# EAGLE design usb-condom (EAGLE 7.5.0)
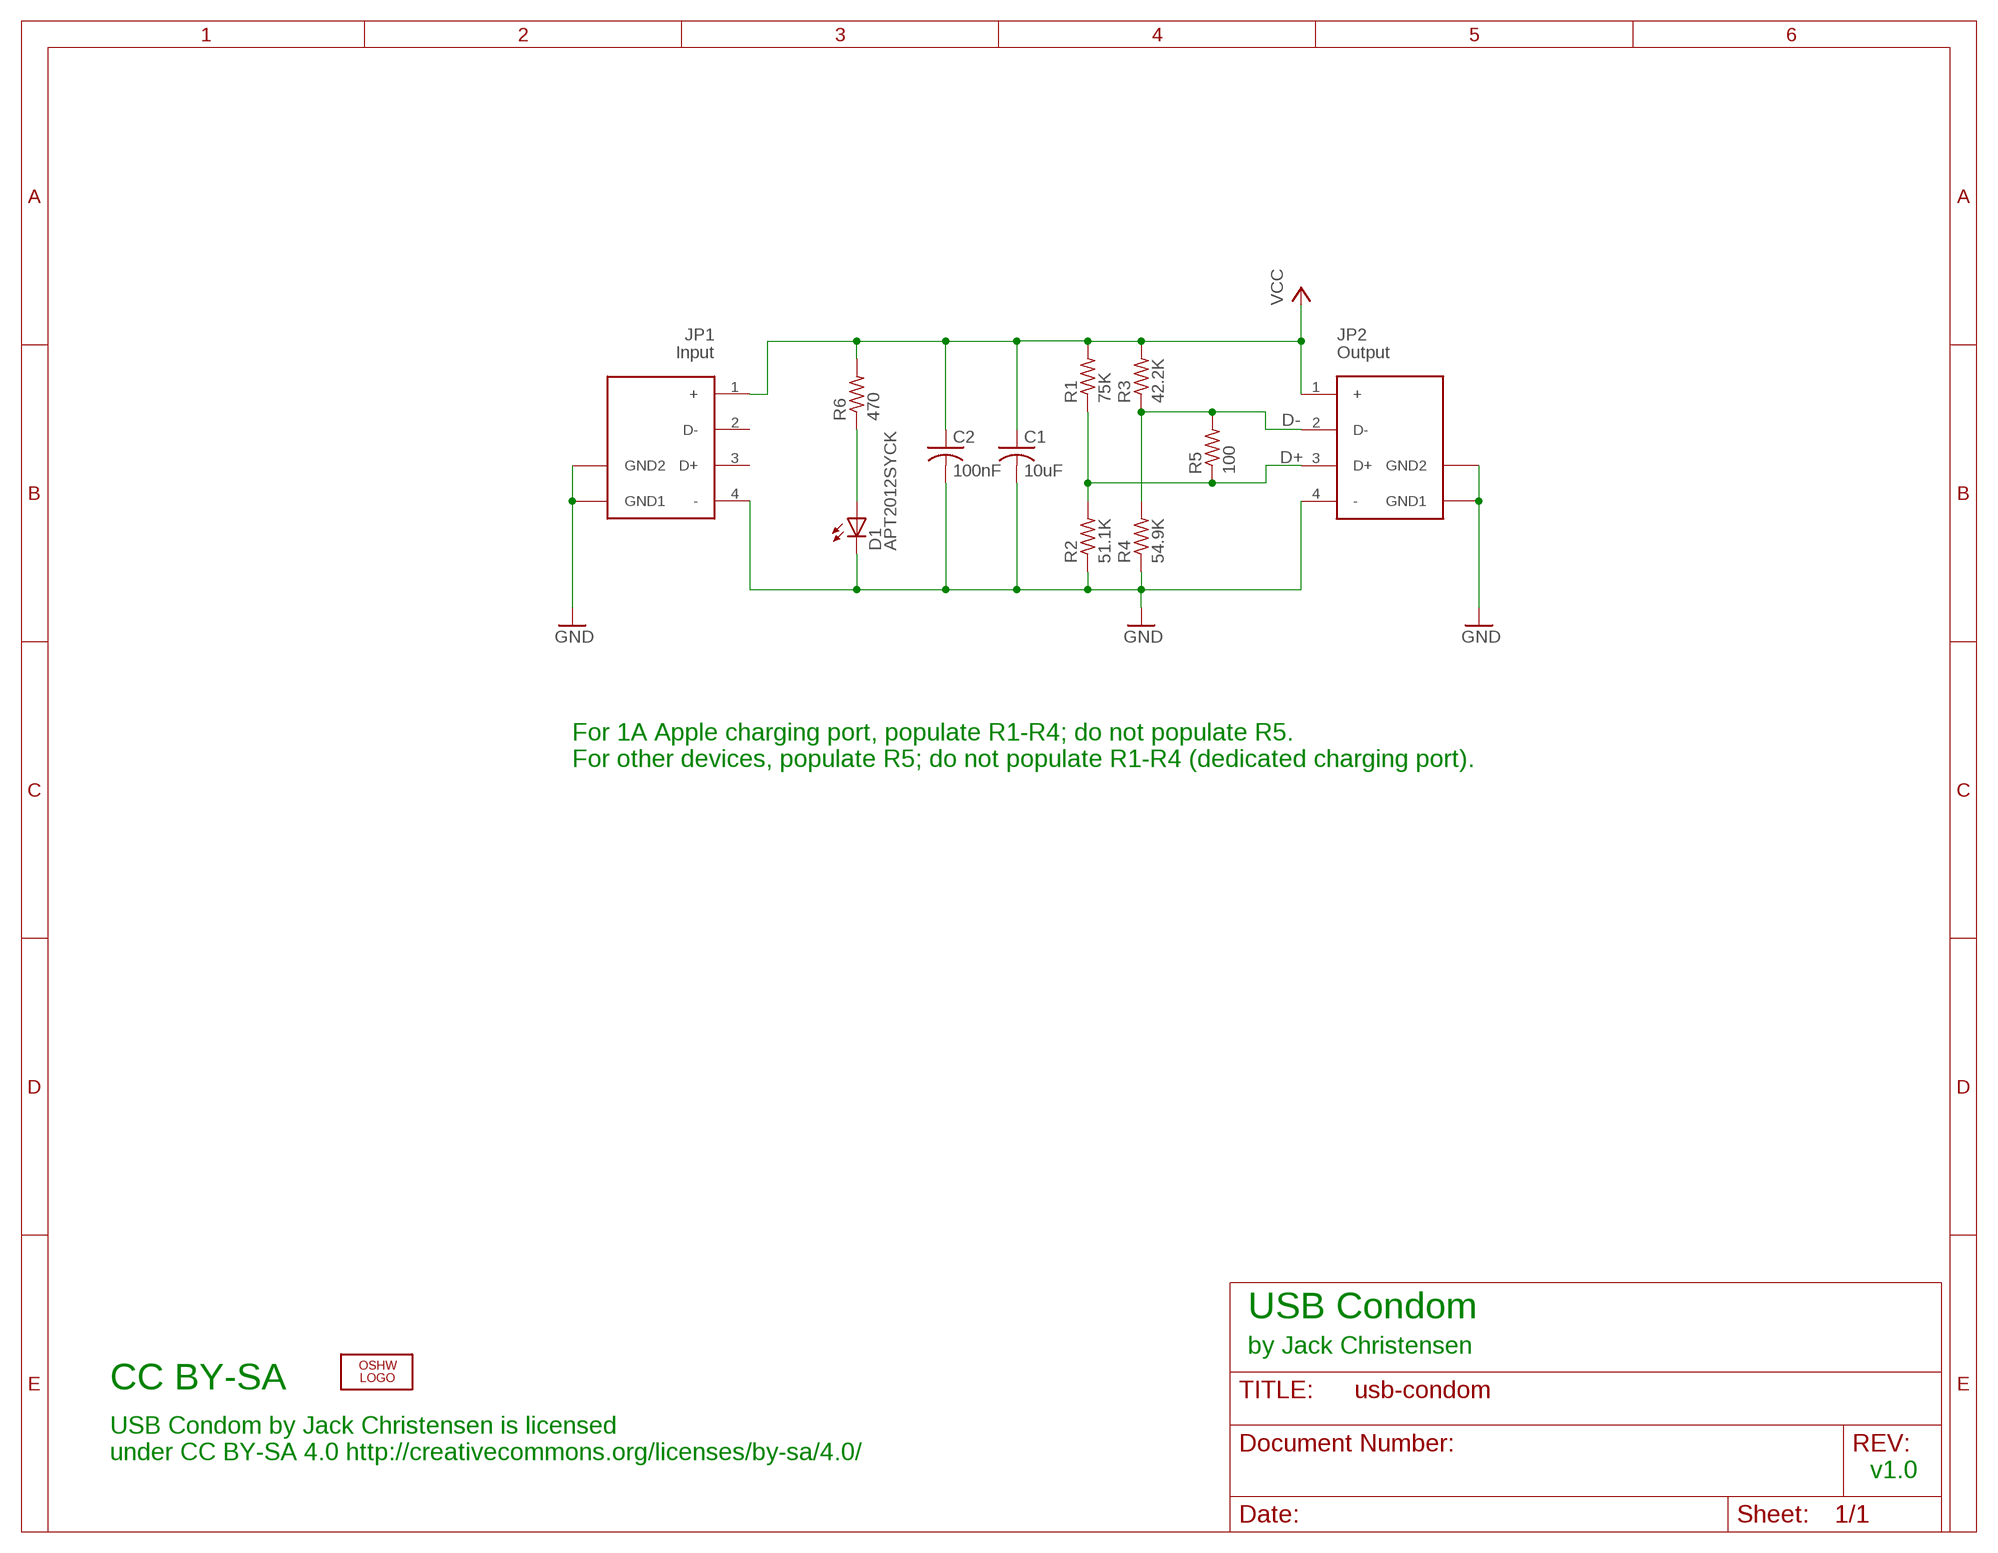
[diagram p0: schematic, sheet 1]

## Parts
C1  10uF  C-USM0805  [M0805]
C2  100nF  C-USM0805  [M0805]
D1  APT2012SYCK  LEDM0805  [M0805]
JP1  Input  UP2-AH-TH  [UP2-AH-X-TH]
JP2  Output  USB-A  [USB-A-S-RA-ADAMTECH]
LOGO1  OSHW_LOGO_8MILX0100-NT  [OSHW_8X100_NOTEXT]
R1  75K  R-US_M0805  [M0805]
R2  51.1K  R-US_M0805  [M0805]
R3  42.2K  R-US_M0805  [M0805]
R4  54.9K  R-US_M0805  [M0805]
R5  100  R-US_M0805  [M0805]
R6  470  R-US_M0805  [M0805]

## Nets
D+: JP2.3(D+) R1.1 R2.2 R5.1
D-: JP2.2(D-) R3.1 R4.2 R5.2
GND: C1.2 C2.2 D1.2(C) JP1.4(-) JP1.P$5(GND1) JP1.P$6(GND2) JP2.4(-) JP2.GND1 JP2.GND2 R2.1 R4.1
N$1: D1.1(A) R6.1
VCC: C1.1 C2.1 JP1.1(+) JP2.1(+) R1.2 R3.2 R6.2
Unconnected: JP1.2(D-) JP1.3(D+)

## Notes on the sheet
- For 1A Apple charging port, populate R1-R4; do not populate R5.
  For other devices, populate R5; do not populate R1-R4 (dedicated charging port).
- USB Condom
- by Jack Christensen
- CC BY-SA
- USB Condom by Jack Christensen is licensed
  under CC BY-SA 4.0 http://creativecommons.org/licenses/by-sa/4.0/
- v1.0

## Library data of the parts
C1 C2 = _jc:C-US: CAPACITOR, American symbol
D1 = _jc:LED: LED OSRAM: - CHIPLED LG R971, LG N971, LY N971, LG Q971, LY Q971, LO R971, LY R971 LH N974, LH R974 LS Q976, LO Q976, LY Q976 LO Q996 - Hyper CHIPLED LW Q18S LB Q993, LB Q99A, LB R99A - SideLED LS A670, LO A670, LY A670, LG A670, LP A670 LB A673, LV A673, LT A673, LW A673 LH A674 LY A675 LS A676, LA A676, LO A676, LY A676, LW A676 LS A679, LY A679, LG A679 - Hyper Micro SIDELED® LS Y876, LA Y876, LO Y876, LY Y876 LT Y87S - SmartLED LW L88C, LW L88S LB L89C, LB L89S, LG L890 LS L89K, LO L89K, LY L89K LS L896, LA L896, LO L896, LY L896 - TOPLED LS T670, LO T670, LY T670, LG T670, LP T670 LSG T670, LSP T670, LSY T670, LOP T670, LYG T670 LG T671, LOG T671, LSG T671 LB T673, LV T673, LT T673, LW T673 LH T674 LS T676, LA T676, LO T676, LY T676, LB T676, LH T676, LSB T676, LW T676 LB T67C, LV T67C, LT T67C, LS T67K, LO T67K, LY T67K, LW E67C LS E67B, LA E67B, LO E67B, LY E67B, LB E67C, LV E67C, LT E67C LW T67C LS T679, LY T679, LG T679 LS T770, LO T770, LY T770, LG T770, LP T770 LB T773, LV T773, LT T773, LW T773 LH T774 LS E675, LA E675, LY E675, LS T675 LS T776, LA T776, LO T776, LY T776, LB T776 LHGB T686 LT T68C, LB T68C - Hyper Mini TOPLED® LB M676 - Mini TOPLED Santana® LG M470 LS M47K, LO M47K, LY M47K Source: http://www.osram.convergy.de/
JP1 = _jc:UP2-AH-TH: CUI Inc. Series UP2-AH-TH Male USB plug.
JP2 = _jc:USB-A
LOGO1 = ohw-logo:OSHW_LOGO_8MIL
R1-R6 = _jc:R-US_: RESISTOR, American symbol

## Board
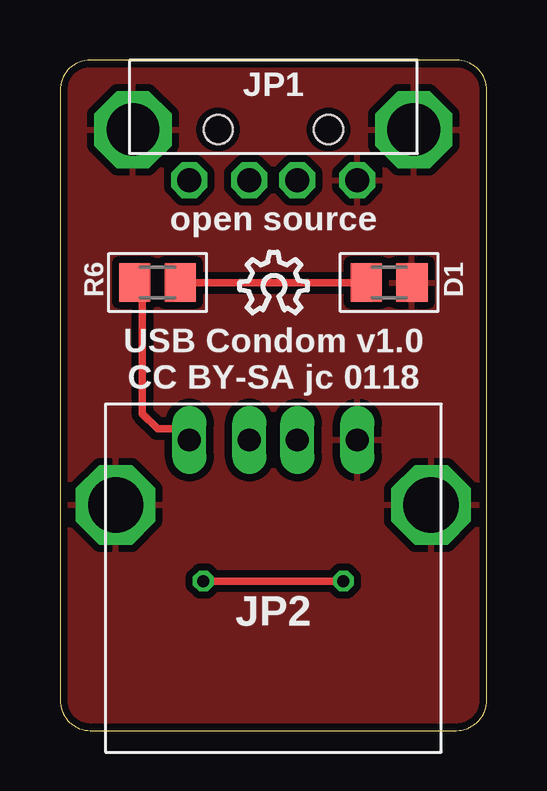
[diagram p1: board, top side]
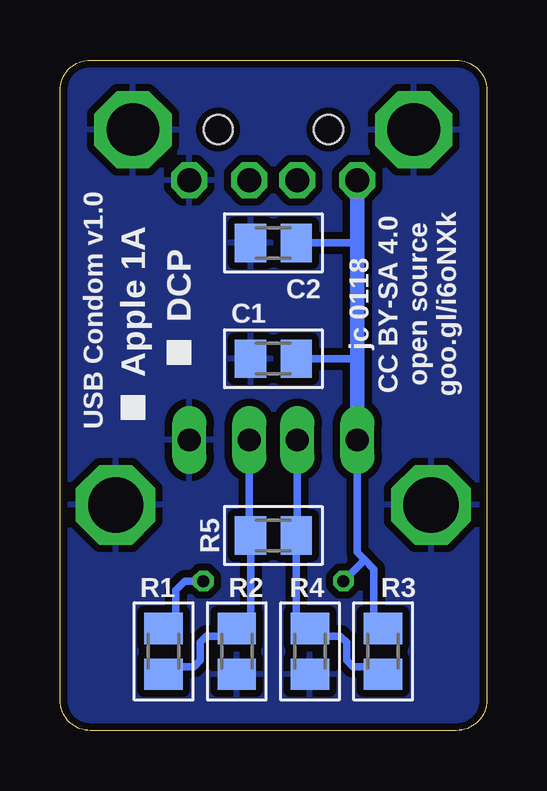
[diagram p2: board, bottom side, seen from below]

Size 17.78 x 27.94 mm. Coordinates in mm from the lower left corner, seen from the top.
Outline: 0,26.67 0,1.27 arc90 1.27,0 16.51,0 arc90 17.78,1.27 17.78,26.67 arc90 16.51,27.94 1.27,27.94 arc90 0,26.67
Copper layers (1*16): Top 0.0356mm / dielectric 1.5011mm / Bottom 0.0356mm
Design rules "oshpark-2layer-jc": minimum track width 8mil, minimum drill 13mil, track to track 8mil, track to pad 8mil, pad to pad 8mil, via to via 8mil, smd to smd 6mil, copper to edge 12mil, drill to drill 6mil, minimum pad ring 7mil, minimum via ring 7mil, stop-mask expansion 2.5mil, vias tented up to drill 20mil, thermal gap 12mil

### Footprints (pad centres in the part's own frame; a part is rotated, then mirrored left to right if it is on the bottom)
M0805 = smd 1.3 x 1.6: 1 -0.95,0; 2 0.95,0
UP2-AH-X-TH = drill 1 octagon: 1 3.5,5; 2 1,5; 3 -1,5; 4 -3.5,5 | drill 2.2 octagon: P$5 5.85,2.9; P$6 -5.85,2.9 | hole 1.2: 2.3,2.9; -2.3,2.9
USB-A-S-RA-ADAMTECH = drill 0.95 long: 1 -3.5,5.76; 2 -1,5.76; 3 1,5.76; 4 3.5,5.76 | drill 2.3 octagon: GND1 6.57,3.05; GND2 -6.57,3.05

### Placement (x,y rotation side)
C1  8.89,15.49 180 bottom
C2  8.89,20.32 180 bottom
D1  13.72,18.67 0 top
JP1  8.89,27.94 180 top
JP2  8.89,6.35 0 top
LOGO1  7.49,17.4 0 top
R1  13.46,3.3 90 bottom
R2  10.41,3.3 90 bottom
R3  4.32,3.3 90 bottom
R4  7.37,3.3 90 bottom
R5  8.89,8.13 0 bottom
R6  4.06,18.67 180 top

### Tracks (layer width: path | path; a pad name or v marks a point on that pad's centre or on a via)
D+
  Bottom 0.305: JP2.3 9.89,8.18 R5.1 9.84,4.83 R2.2 10.73,3.94 11.68,3.94 11.94,3.68 11.94,2.92 12.19,2.67 12.83,2.67 13.14,2.35 R1.1
D-
  Bottom 0.305: JP2.2 7.89,8.18 R5.2 7.94,4.83 R4.2 7.05,3.94 6.1,3.94 5.84,3.68 5.84,2.92 5.59,2.67 4.83,2.67 4.51,2.35 R3.1
GND
  pour Top (isolate 0.305): -2.54,30.48 20.32,30.48 20.32,-3.81 -2.54,-3.81
  pour Bottom (isolate 0.305): -1.27,-2.54 -1.27,29.21 19.05,29.21 19.05,-2.54
N$1
  Top 0.305: R6.1 D1.1
VCC  (via drill 0.5)
  Top 0.305: v11.81,6.22 v5.97,6.22 | R6.2 3.17,18.67 3.43,18.41 3.43,13.21 4.06,12.57 4.93,12.57 JP2.1
  Bottom 0.305: JP2.1 5.39,7.42 5.08,7.11 | 5.08,7.11 4.7,6.73 4.7,4.63 R3.2 | v5.97,6.22 5.08,7.11 | 5.52,16.38 5.39,16.51 | 5.39,20.32 5.52,20.19 5.64,20.32 C2.1 | v11.81,6.22 12.57,6.22 12.95,5.84 12.95,4.76 R1.2 | C1.1 5.64,15.49 5.39,15.24
  Bottom 0.61: 4.45,4.38 R3.2 | JP2.1 5.39,15.24 5.39,16.51 5.39,20.32 JP1.1

### Text on the board
tPlace: open source | USB Condom v1.0 / CC BY-SA jc 0118
bPlace: jc 0118 / CC BY-SA 4.0 / open source / goo.gl/i6oNXk | USB Condom v1.0 | DCP | Apple 1A